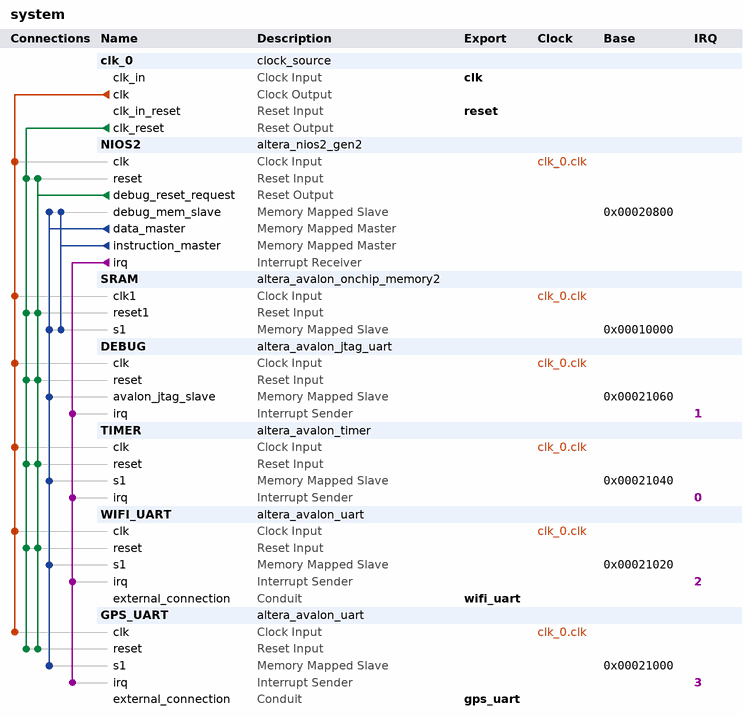
[diagram p0: system contents]
# Platform Designer (Qsys) system system, Cyclone V 5CSEMA5F31C6
# Parameters at their usual value, and those the tool derives, are not listed.
package require -exact qsys 19.1
create_system system
set_project_property DEVICE_FAMILY {Cyclone V}
set_project_property DEVICE 5CSEMA5F31C6

add_instance clk_0 clock_source 19.1
set_instance_parameter_value clk_0 clockFrequency 50000000

add_instance NIOS2 altera_nios2_gen2 19.1
set_instance_parameter_value NIOS2 dcache_size 2048
set_instance_parameter_value NIOS2 exceptionSlave SRAM.s1
set_instance_parameter_value NIOS2 icache_size 4096
set_instance_parameter_value NIOS2 impl Tiny
set_instance_parameter_value NIOS2 resetSlave SRAM.s1

add_instance SRAM altera_avalon_onchip_memory2 19.1
set_instance_parameter_value SRAM dataWidth 32
set_instance_parameter_value SRAM dualPort false
set_instance_parameter_value SRAM initMemContent true
set_instance_parameter_value SRAM initializationFileName onchip_mem.hex
set_instance_parameter_value SRAM memorySize 40960

add_instance DEBUG altera_avalon_jtag_uart 19.1
set_instance_parameter_value DEBUG simInteractiveOptions NO_INTERACTIVE_WINDOWS

add_instance TIMER altera_avalon_timer 19.1
set_instance_parameter_value TIMER period 60
set_instance_parameter_value TIMER periodUnits SEC

add_instance WIFI_UART altera_avalon_uart 19.1
set_instance_parameter_value WIFI_UART baud 115200
set_instance_parameter_value WIFI_UART dataBits 8
set_instance_parameter_value WIFI_UART fixedBaud true
set_instance_parameter_value WIFI_UART parity NONE
set_instance_parameter_value WIFI_UART stopBits 1

add_instance GPS_UART altera_avalon_uart 19.1
set_instance_parameter_value GPS_UART baud 9600
set_instance_parameter_value GPS_UART dataBits 8
set_instance_parameter_value GPS_UART fixedBaud true
set_instance_parameter_value GPS_UART parity NONE
set_instance_parameter_value GPS_UART stopBits 1

# connections
add_connection clk_0.clk DEBUG.clk clock
add_connection clk_0.clk GPS_UART.clk clock
add_connection clk_0.clk NIOS2.clk clock
add_connection clk_0.clk SRAM.clk1 clock
add_connection clk_0.clk TIMER.clk clock
add_connection clk_0.clk WIFI_UART.clk clock
add_connection clk_0.clk_reset DEBUG.reset reset
add_connection clk_0.clk_reset GPS_UART.reset reset
add_connection clk_0.clk_reset NIOS2.reset reset
add_connection clk_0.clk_reset SRAM.reset1 reset
add_connection clk_0.clk_reset TIMER.reset reset
add_connection clk_0.clk_reset WIFI_UART.reset reset
add_connection NIOS2.debug_reset_request DEBUG.reset reset
add_connection NIOS2.debug_reset_request GPS_UART.reset reset
add_connection NIOS2.debug_reset_request NIOS2.reset reset
add_connection NIOS2.debug_reset_request SRAM.reset1 reset
add_connection NIOS2.debug_reset_request TIMER.reset reset
add_connection NIOS2.debug_reset_request WIFI_UART.reset reset
add_connection NIOS2.data_master DEBUG.avalon_jtag_slave avalon
set_connection_parameter_value NIOS2.data_master/DEBUG.avalon_jtag_slave baseAddress 0x00021060
add_connection NIOS2.data_master GPS_UART.s1 avalon
set_connection_parameter_value NIOS2.data_master/GPS_UART.s1 baseAddress 0x00021000
add_connection NIOS2.data_master NIOS2.debug_mem_slave avalon
set_connection_parameter_value NIOS2.data_master/NIOS2.debug_mem_slave baseAddress 0x00020800
add_connection NIOS2.data_master SRAM.s1 avalon
set_connection_parameter_value NIOS2.data_master/SRAM.s1 baseAddress 0x00010000
add_connection NIOS2.data_master TIMER.s1 avalon
set_connection_parameter_value NIOS2.data_master/TIMER.s1 baseAddress 0x00021040
add_connection NIOS2.data_master WIFI_UART.s1 avalon
set_connection_parameter_value NIOS2.data_master/WIFI_UART.s1 baseAddress 0x00021020
add_connection NIOS2.instruction_master NIOS2.debug_mem_slave avalon
set_connection_parameter_value NIOS2.instruction_master/NIOS2.debug_mem_slave baseAddress 0x00020800
add_connection NIOS2.instruction_master SRAM.s1 avalon
set_connection_parameter_value NIOS2.instruction_master/SRAM.s1 baseAddress 0x00010000
add_connection NIOS2.irq DEBUG.irq interrupt
set_connection_parameter_value NIOS2.irq/DEBUG.irq irqNumber 1
add_connection NIOS2.irq GPS_UART.irq interrupt
set_connection_parameter_value NIOS2.irq/GPS_UART.irq irqNumber 3
add_connection NIOS2.irq TIMER.irq interrupt
set_connection_parameter_value NIOS2.irq/TIMER.irq irqNumber 0
add_connection NIOS2.irq WIFI_UART.irq interrupt
set_connection_parameter_value NIOS2.irq/WIFI_UART.irq irqNumber 2

# exported interfaces
add_interface clk clock sink
set_interface_property clk EXPORT_OF clk_0.clk_in
add_interface gps_uart conduit end
set_interface_property gps_uart EXPORT_OF GPS_UART.external_connection
add_interface reset reset sink
set_interface_property reset EXPORT_OF clk_0.clk_in_reset
add_interface wifi_uart conduit end
set_interface_property wifi_uart EXPORT_OF WIFI_UART.external_connection

set_interconnect_requirement {$system} qsys_mm.clockCrossingAdapter HANDSHAKE
set_interconnect_requirement {$system} qsys_mm.enableEccProtection FALSE
set_interconnect_requirement {$system} qsys_mm.insertDefaultSlave FALSE
set_interconnect_requirement {$system} qsys_mm.maxAdditionalLatency 1

save_system system.qsys
